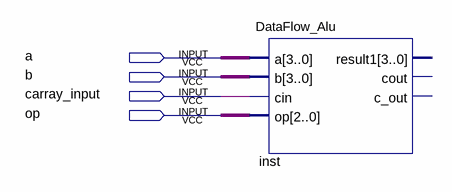
[diagram p0: schematic sheet]
// Quartus schematic Symbol_dataFlow.bdf as structural Verilog: 1 symbols, 4 pins
module Symbol_dataFlow (
  input  a,
  input  b,
  input  carray_input,
  input  op
);

  wire [2:0] undriven_2;
  wire [3:0] undriven, undriven_3;

  DataFlow_Alu inst (.a(undriven), .b(undriven_3), .cin(carray_input), .op(undriven_2));  // open: result1, cout, c_out
endmodule
